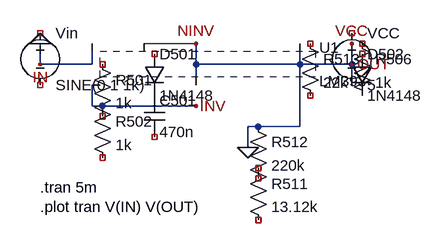
[diagram p0: schematic sch_clean_update.asc]
sch_clean_update.asc, the LTspice schematic file:
Version 4
SHEET 1 880 680

WIRE 80 128 80 160
WIRE 80 160 160 160
WIRE 160 160 160 128
WIRE 160 192 160 224
WIRE 160 224 240 224
WIRE 240 224 320 224
WIRE 240 128 320 128
WIRE 320 128 320 160
WIRE 320 160 320 192
WIRE 320 160 400 160
WIRE 400 160 480 160
WIRE 480 160 480 128
WIRE 480 160 480 192
WIRE 480 224 480 192
WIRE 480 224 480 256
WIRE 480 256 400 256
WIRE 400 256 400 288
WIRE 480 160 560 160
WIRE 560 160 560 128
WIRE 560 160 560 192

FLAG 80 128 0
FLAG 560 128 VCC
FLAG 400 288 0
FLAG 80 160 IN
FLAG 320 128 NINV
FLAG 320 224 INV
FLAG 560 160 OUT

SYMBOL voltage 80 96 R0
WINDOW 3 24 96 Left 0
SYMATTR InstName Vin
SYMATTR Value SINE(0 1 1k)

SYMBOL res 160 144 R0
SYMATTR InstName R501
SYMATTR Value 1k

SYMBOL res 160 208 R0
SYMATTR InstName R502
SYMATTR Value 1k

SYMBOL cap 240 208 R0
SYMATTR InstName C501
SYMATTR Value 470n

SYMBOL diode 240 144 R0
SYMATTR InstName D501
SYMATTR Value 1N4148

SYMBOL opamp2 320 160 R0
SYMATTR InstName U1
SYMATTR Value LM393

SYMBOL res 480 112 R0
SYMATTR InstName R513
SYMATTR Value 22k

SYMBOL res 400 240 R0
SYMATTR InstName R512
SYMATTR Value 220k

SYMBOL res 400 304 R0
SYMATTR InstName R511
SYMATTR Value 13.12k

SYMBOL diode 560 144 R0
SYMATTR InstName D502
SYMATTR Value 1N4148

SYMBOL res 560 112 R0
SYMATTR InstName R506
SYMATTR Value 1k

SYMBOL voltage 560 96 R0
SYMATTR InstName VCC
SYMATTR Value 5

TEXT 80 350 Left 0 !.tran 5m
TEXT 80 380 Left 0 !.plot tran V(IN) V(OUT)

The netlist it stands for:
* sch_clean_update.asc
Vin NC_01 NC_02 SINE(0 1 1k)
R501 NC_03 NC_04 1k
R502 INV NC_05 1k
C501 P001 NC_06 470n
D501 NC_07 P001 1N4148
* U1: LM393 (symbol opamp2 not available, pin order unknown); nets seen at it: 0, INV
R513 NC_08 NC_09 22k
R512 0 NC_10 220k
R511 NC_11 NC_12 13.12k
D502 NC_13 P002 1N4148
R506 NC_14 P002 1k
VCC NC_15 0 5
.model D D
.lib standard.dio
.tran 5m
.plot tran V(IN) V(OUT)
.backanno
.end